# Altium schematic sheet [4]Misc_Parts.SchDoc
size A3
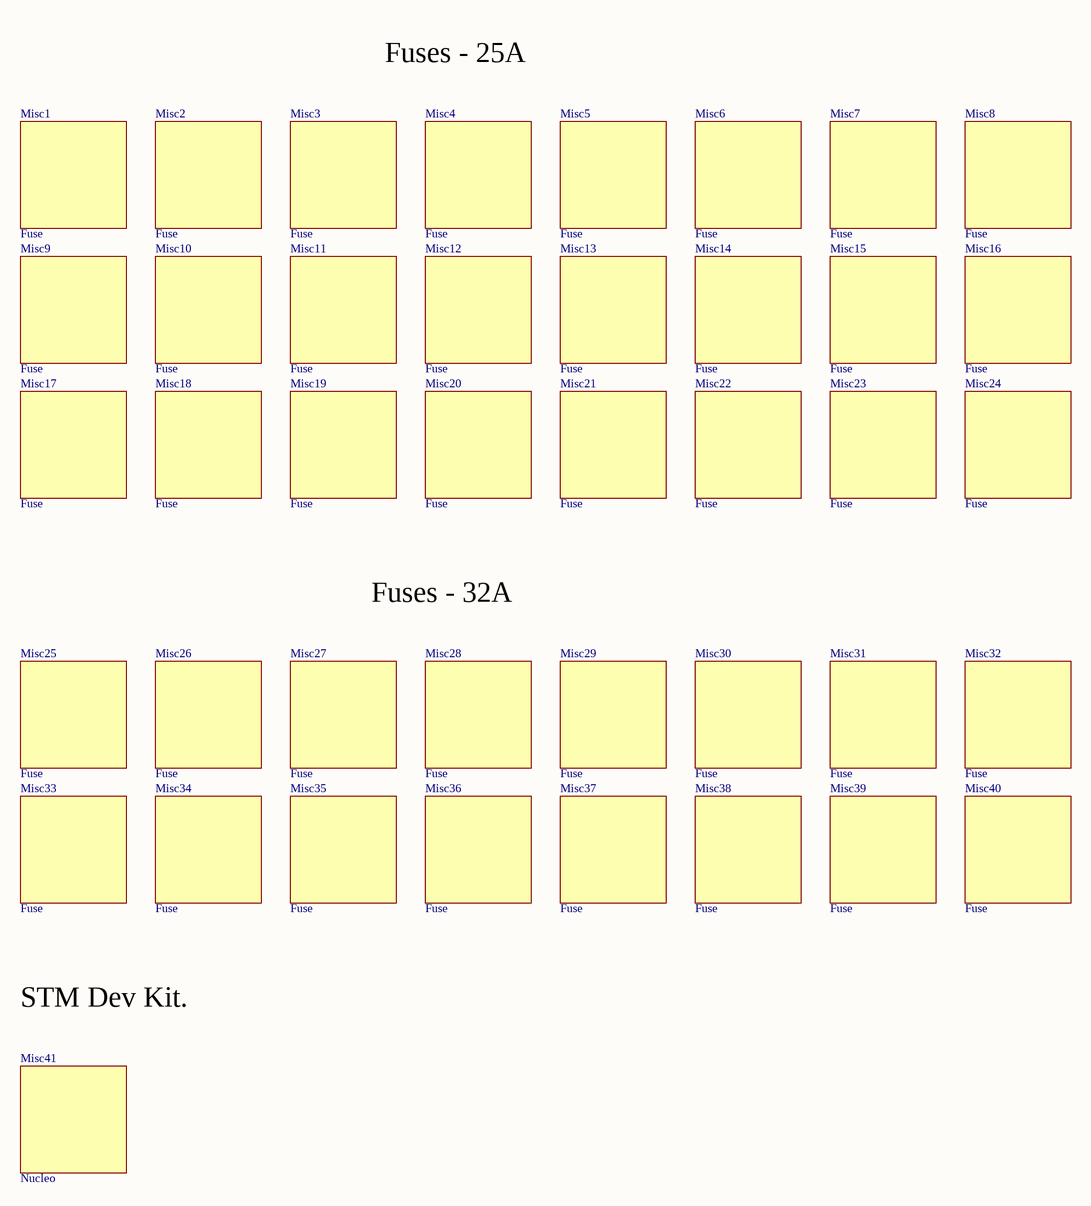
[diagram p0: [4]Misc_Parts.SchDoc]

## Parts
Misc1  Fuse  (mechanical)
Misc2  Fuse  (mechanical)
Misc3  Fuse  (mechanical)
Misc4  Fuse  (mechanical)
Misc5  Fuse  (mechanical)
Misc6  Fuse  (mechanical)
Misc7  Fuse  (mechanical)
Misc8  Fuse  (mechanical)
Misc9  Fuse  (mechanical)
Misc10  Fuse  (mechanical)
Misc11  Fuse  (mechanical)
Misc12  Fuse  (mechanical)
Misc13  Fuse  (mechanical)
Misc14  Fuse  (mechanical)
Misc15  Fuse  (mechanical)
Misc16  Fuse  (mechanical)
Misc17  Fuse  (mechanical)
Misc18  Fuse  (mechanical)
Misc19  Fuse  (mechanical)
Misc20  Fuse  (mechanical)
Misc21  Fuse  (mechanical)
Misc22  Fuse  (mechanical)
Misc23  Fuse  (mechanical)
Misc24  Fuse  (mechanical)
Misc25  Fuse  (mechanical)
Misc26  Fuse  (mechanical)
Misc27  Fuse  (mechanical)
Misc28  Fuse  (mechanical)
Misc29  Fuse  (mechanical)
Misc30  Fuse  (mechanical)
Misc31  Fuse  (mechanical)
Misc32  Fuse  (mechanical)
Misc33  Fuse  (mechanical)
Misc34  Fuse  (mechanical)
Misc35  Fuse  (mechanical)
Misc36  Fuse  (mechanical)
Misc37  Fuse  (mechanical)
Misc38  Fuse  (mechanical)
Misc39  Fuse  (mechanical)
Misc40  Fuse  (mechanical)
Misc41  Nucleo  (mechanical)

## Notes on the sheet
- Fuses - 25A
- Fuses - 32A
- STM Dev Kit.

## Library data of the parts
Misc1-Misc24 = Empty Component: Manufacturer Part No.: 8020.5025; Manufacturer Name: Schurter; Distributor Link: https://www.mouser.co.uk/ProductDetail/Schurter/80205025?qs=sGAEpiMZZMsIz3CjQ1xegWCT6TrQpP45zKPj%2FqTQoTr48FM%2FPi2y3g%3D%3D
Misc25-Misc40 = Empty Component: Manufacturer Part No.: 8020.5026; Manufacturer Name: Schurter; Distributor Link: https://www.digikey.com/product-detail/en/schurter-inc/8020.5026/486-3295-ND/6568978
Misc41 = Empty Component: Manufacturer Part No.: NUCLEO-F030R8; Manufacturer Name: STMicroelectronics; Distributor Link: https://eu.mouser.com/ProductDetail/STMicroelectronics/NUCLEO-F030R8?qs=fK8dlpkaUMvL9GSuoYnNYw%3D%3D